# Altium schematic sheet fpga.SchDoc
size 381 x 241 mm; SheetNumber: 13; SheetTotal: 17
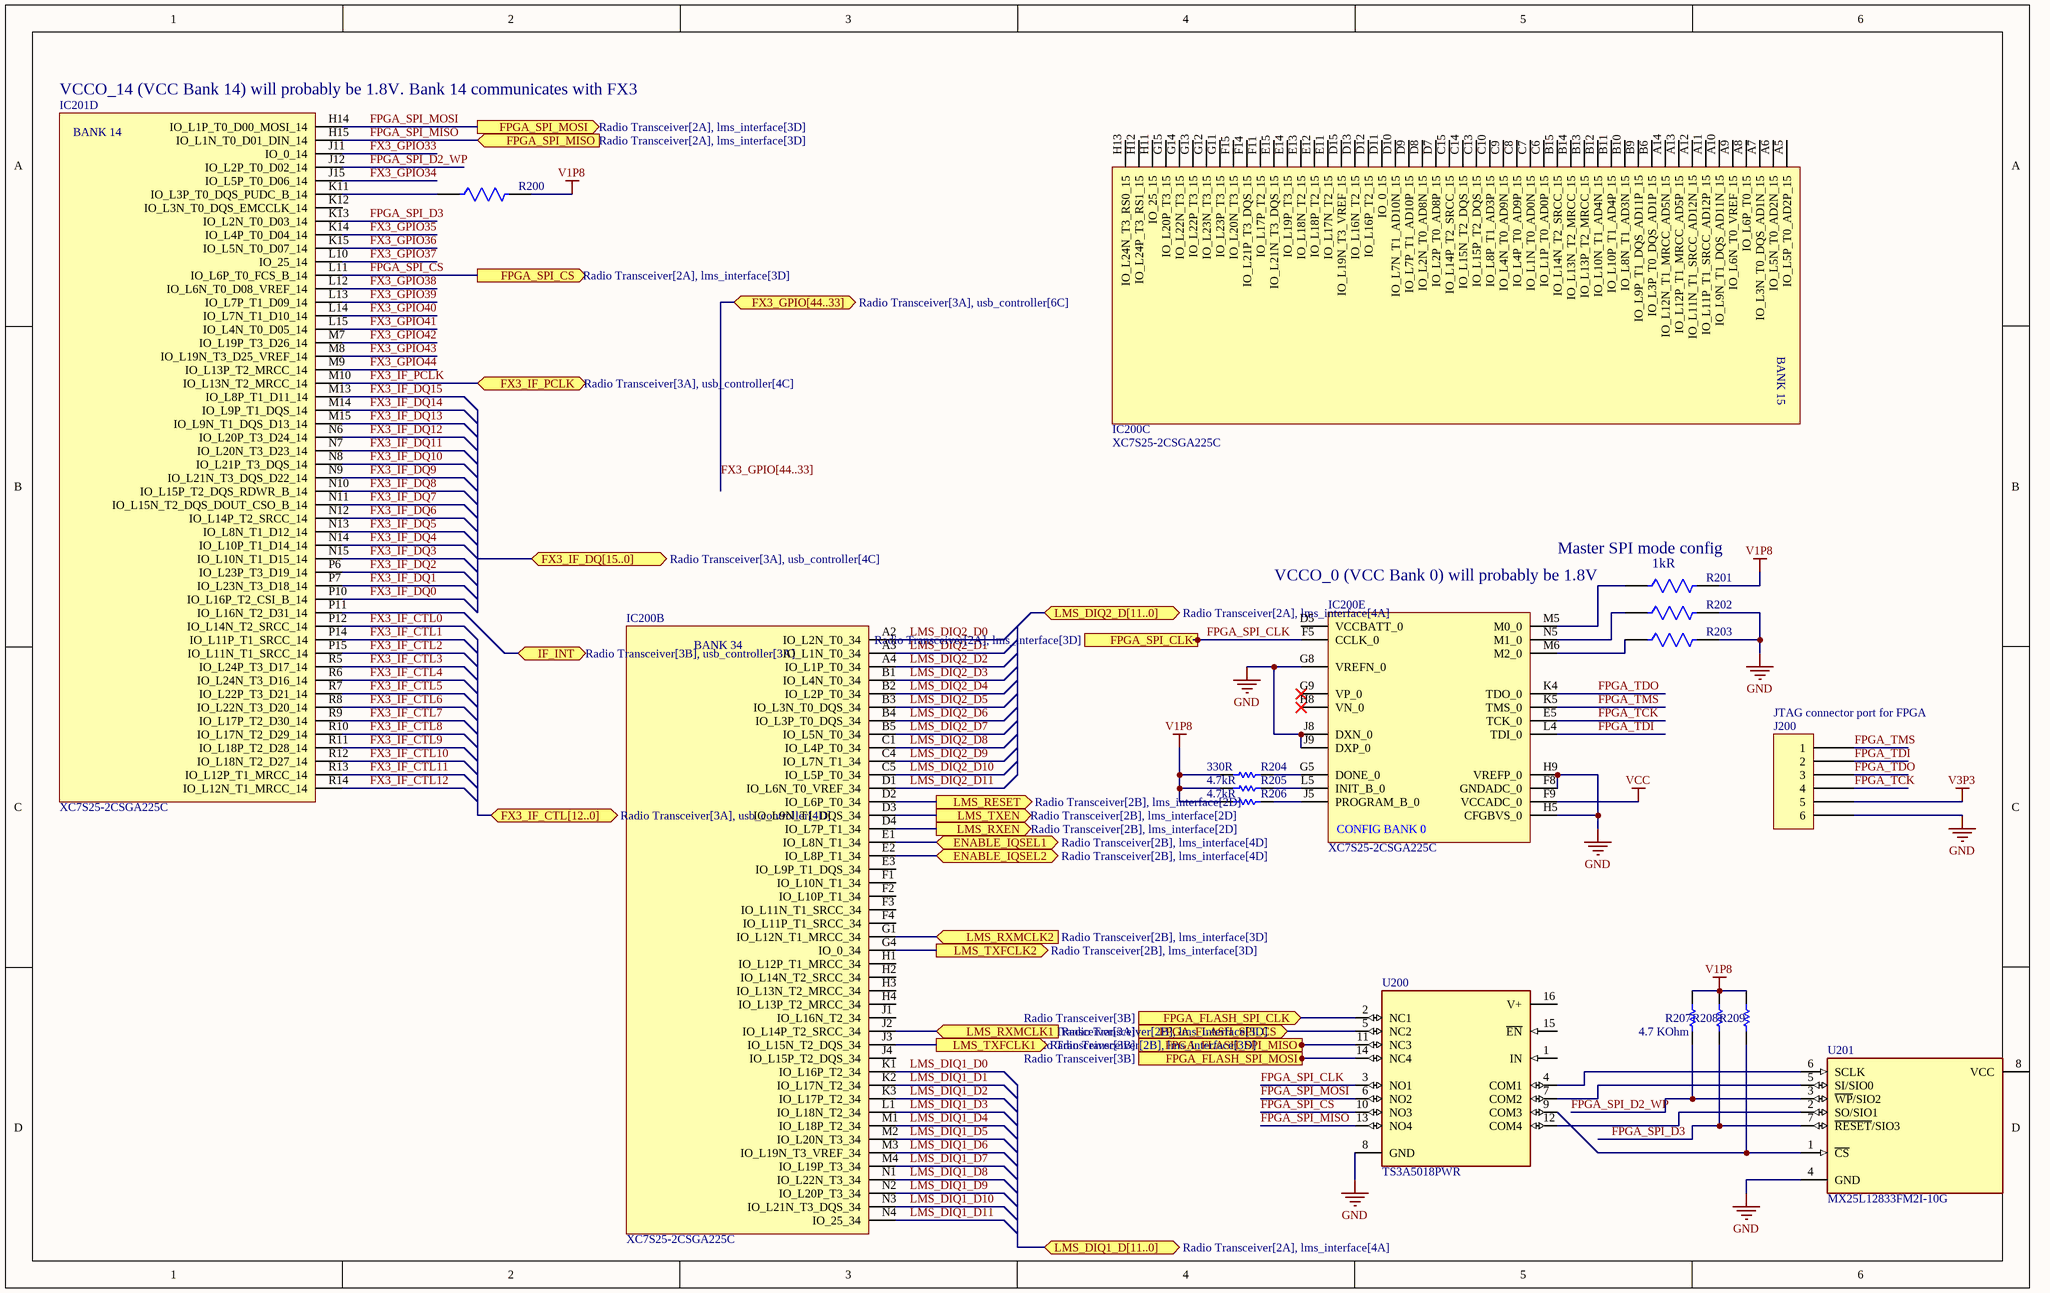
[diagram p0: fpga.SchDoc]

## Parts
(Parts that share a designator on the sheet are numbered #1, #2 ... from top to bottom, then left to right.)
IC200#1  XC7S25-2CSGA225C  [BGA225C80P15X15_1300X1300X140]  (part C of 5)
IC200#2  XC7S25-2CSGA225C  [BGA225C80P15X15_1300X1300X140]  (part E of 6)
IC200#3  XC7S25-2CSGA225C  [BGA225C80P15X15_1300X1300X140]  (part B of 4)
IC201  XC7S25-2CSGA225C  [BGA225C80P15X15_1300X1300X140]  (part D of 5)
J200  JTAG connector port for FPGA  [SULLINS NPPN061BFCN]
R200  AC0603FR-071KL  [FP-AC0603-IPC_B]  (value not drawn)
R201  value 1kR  [FP-AC0603-IPC_B]  (hidden comment: AC0603FR-071KL)
R202  AC0603FR-071KL  [FP-AC0603-IPC_B]  (value not drawn)
R203  AC0603FR-071KL  [FP-AC0603-IPC_B]  (value not drawn)
R204  value 330R  [RESC1005X40X25ML05T05]  (hidden comment: ERJ2RKF3300X)
R205  value 4.7kR  [RESC1005X40X25LL05T05]  (hidden comment: ERJ-2RKF4701X)
R206  value 4.7kR  [RESC1005X40X25LL05T05]  (hidden comment: ERJ-2RKF4701X)
R207  Resistance: 4.7 KOhm  [RESC1005X40X25LL05T05]  (hidden comment: ERJ-2RKF4701X)
R208  ERJ-2RKF4701X  [RESC1005X40X25LL05T05]  (value not drawn)
R209  ERJ-2RKF4701X  [RESC1005X40X25LL05T05]  (value not drawn)
U200  TS3A5018PWR  [FP-PW0016A-IPC_B]
U201  MX25L12833FM2I-10G  [FP-MX25L12833FM2I-10G-MFG]

## Ports
ENABLE_IQSEL1 (bidir, see Radio Transceiver[2B], lms_interface[4D]), ENABLE_IQSEL2 (bidir, see Radio Transceiver[2B], lms_interface[4D]), FPGA_FLASH_SPI_CLK (in, see Radio Transceiver[3B]), FPGA_FLASH_SPI_CS (in, see Radio Transceiver[3A]), FPGA_FLASH_SPI_MISO (out, see Radio Transceiver[3B]), FPGA_FLASH_SPI_MOSI (in, see Radio Transceiver[3B]), FPGA_SPI_CLK (out, see Radio Transceiver[2A], lms_interface[3D]), FPGA_SPI_CS (out, see Radio Transceiver[2A], lms_interface[3D]), FPGA_SPI_MISO (in, see Radio Transceiver[2A], lms_interface[3D]), FPGA_SPI_MOSI (out, see Radio Transceiver[2A], lms_interface[3D]), FX3_GPIO[44..33] (bidir, see Radio Transceiver[3A], usb_controller[6C]), FX3_IF_CTL[12..0] (bidir, see Radio Transceiver[3A], usb_controller[4D]), FX3_IF_DQ[15..0] (bidir, see Radio Transceiver[3A], usb_controller[4C]), FX3_IF_PCLK (bidir, see Radio Transceiver[3A], usb_controller[4C]), IF_INT (bidir, see Radio Transceiver[3B], usb_controller[3A]), LMS_DIQ1_D[11..0] (bidir, see Radio Transceiver[2A], lms_interface[4A]), LMS_DIQ2_D[11..0] (bidir, see Radio Transceiver[2A], lms_interface[4A]), LMS_RESET (out, see Radio Transceiver[2B], lms_interface[2D]), LMS_RXEN (out, see Radio Transceiver[2B], lms_interface[2D]), LMS_RXMCLK1 (in, see Radio Transceiver[2B], lms_interface[3D]), LMS_RXMCLK2 (in, see Radio Transceiver[2B], lms_interface[3D]), LMS_TXEN (out, see Radio Transceiver[2B], lms_interface[2D]), LMS_TXFCLK1 (out, see Radio Transceiver[2B], lms_interface[3D]), LMS_TXFCLK2 (out, see Radio Transceiver[2B], lms_interface[3D])

## Nets
GND: IC200#2.F8(GNDADC_0) IC200#2.G8(VREFN_0) IC200#2.H5(CFGBVS_0) IC200#2.H9(VREFP_0) IC200#2.J8(DXN_0) IC200#2.J9(DXP_0) J200.6 R202.2 R203.2 U200.8(GND) U201.4(GND)
V1P8: R200.2 R201.2 R204.1 R205.1 R206.1 R207.2 R208.2 R209.2
V3P3: J200.5
VCC: IC200#2.F9(VCCADC_0)
ENABLE_IQSEL1: IC200#3.E1(IO_L8N_T1_34) ; port ENABLE_IQSEL1
ENABLE_IQSEL2: IC200#3.E2(IO_L8P_T1_34) ; port ENABLE_IQSEL2
FPGA_FLASH_SPI_CLK: U200.2(NC1) ; port FPGA_FLASH_SPI_CLK
FPGA_FLASH_SPI_CS: U200.5(NC2) ; port FPGA_FLASH_SPI_CS
FPGA_FLASH_SPI_MISO: U200.11(NC3) ; port FPGA_FLASH_SPI_MISO
FPGA_FLASH_SPI_MOSI: U200.14(NC4) ; port FPGA_FLASH_SPI_MOSI
FPGA_SPI_CLK: IC200#2.F5(CCLK_0) U200.3(NO1) ; port FPGA_SPI_CLK
FPGA_SPI_CS: IC201.L11(IO_L6P_T0_FCS_B_14) U200.10(NO3) ; port FPGA_SPI_CS
FPGA_SPI_D2_WP: IC201.J12(IO_L2P_T0_D02_14) R207.1 U201.3(~{WP}/SIO2)
FPGA_SPI_D3: IC201.K13(IO_L2N_T0_D03_14) R208.1 U201.7(~{RESET}/SIO3)
FPGA_SPI_MISO: IC201.H15(IO_L1N_T0_D01_DIN_14) U200.13(NO4) ; port FPGA_SPI_MISO
FPGA_SPI_MOSI: IC201.H14(IO_L1P_T0_D00_MOSI_14) U200.6(NO2) ; port FPGA_SPI_MOSI
FPGA_TCK: IC200#2.E5(TCK_0) J200.4
FPGA_TDI: IC200#2.L4(TDI_0) J200.2
FPGA_TDO: IC200#2.K4(TDO_0) J200.3
FPGA_TMS: IC200#2.K5(TMS_0) J200.1
FX3_GPIO33: IC201.J11(IO_0_14)
FX3_GPIO34: IC201.J15(IO_L5P_T0_D06_14)
FX3_GPIO35: IC201.K14(IO_L4P_T0_D04_14)
FX3_GPIO36: IC201.K15(IO_L5N_T0_D07_14)
FX3_GPIO37: IC201.L10(IO_25_14)
FX3_GPIO38: IC201.L12(IO_L6N_T0_D08_VREF_14)
FX3_GPIO39: IC201.L13(IO_L7P_T1_D09_14)
FX3_GPIO40: IC201.L14(IO_L7N_T1_D10_14)
FX3_GPIO41: IC201.L15(IO_L4N_T0_D05_14)
FX3_GPIO42: IC201.M7(IO_L19P_T3_D26_14)
FX3_GPIO43: IC201.M8(IO_L19N_T3_D25_VREF_14)
FX3_GPIO44: IC201.M9(IO_L13P_T2_MRCC_14)
FX3_IF_CTL0: IC201.P12(IO_L14N_T2_SRCC_14)
FX3_IF_CTL1: IC201.P14(IO_L11P_T1_SRCC_14)
FX3_IF_CTL2: IC201.P15(IO_L11N_T1_SRCC_14)
FX3_IF_CTL3: IC201.R5(IO_L24P_T3_D17_14)
FX3_IF_CTL4: IC201.R6(IO_L24N_T3_D16_14)
FX3_IF_CTL5: IC201.R7(IO_L22P_T3_D21_14)
FX3_IF_CTL6: IC201.R8(IO_L22N_T3_D20_14)
FX3_IF_CTL7: IC201.R9(IO_L17P_T2_D30_14)
FX3_IF_CTL8: IC201.R10(IO_L17N_T2_D29_14)
FX3_IF_CTL9: IC201.R11(IO_L18P_T2_D28_14)
FX3_IF_CTL10: IC201.R12(IO_L18N_T2_D27_14)
FX3_IF_CTL11: IC201.R13(IO_L12P_T1_MRCC_14)
FX3_IF_CTL12: IC201.R14(IO_L12N_T1_MRCC_14)
FX3_IF_DQ0: IC201.P10(IO_L16P_T2_CSI_B_14)
FX3_IF_DQ1: IC201.P7(IO_L23N_T3_D18_14)
FX3_IF_DQ2: IC201.P6(IO_L23P_T3_D19_14)
FX3_IF_DQ3: IC201.N15(IO_L10N_T1_D15_14)
FX3_IF_DQ4: IC201.N14(IO_L10P_T1_D14_14)
FX3_IF_DQ5: IC201.N13(IO_L8N_T1_D12_14)
FX3_IF_DQ6: IC201.N12(IO_L14P_T2_SRCC_14)
FX3_IF_DQ7: IC201.N11(IO_L15N_T2_DQS_DOUT_CSO_B_14)
FX3_IF_DQ8: IC201.N10(IO_L15P_T2_DQS_RDWR_B_14)
FX3_IF_DQ9: IC201.N9(IO_L21N_T3_DQS_D22_14)
FX3_IF_DQ10: IC201.N8(IO_L21P_T3_DQS_14)
FX3_IF_DQ11: IC201.N7(IO_L20N_T3_D23_14)
FX3_IF_DQ12: IC201.N6(IO_L20P_T3_D24_14)
FX3_IF_DQ13: IC201.M15(IO_L9N_T1_DQS_D13_14)
FX3_IF_DQ14: IC201.M14(IO_L9P_T1_DQS_14)
FX3_IF_DQ15: IC201.M13(IO_L8P_T1_D11_14)
FX3_IF_PCLK: IC201.M10(IO_L13N_T2_MRCC_14) ; port FX3_IF_PCLK
IF_INT: IC201.P11(IO_L16N_T2_D31_14) ; port IF_INT
LMS_DIQ1_D0: IC200#3.K1(IO_L16P_T2_34)
LMS_DIQ1_D1: IC200#3.K2(IO_L17N_T2_34)
LMS_DIQ1_D2: IC200#3.K3(IO_L17P_T2_34)
LMS_DIQ1_D3: IC200#3.L1(IO_L18N_T2_34)
LMS_DIQ1_D4: IC200#3.M1(IO_L18P_T2_34)
LMS_DIQ1_D5: IC200#3.M2(IO_L20N_T3_34)
LMS_DIQ1_D6: IC200#3.M3(IO_L19N_T3_VREF_34)
LMS_DIQ1_D7: IC200#3.M4(IO_L19P_T3_34)
LMS_DIQ1_D8: IC200#3.N1(IO_L22N_T3_34)
LMS_DIQ1_D9: IC200#3.N2(IO_L20P_T3_34)
LMS_DIQ1_D10: IC200#3.N3(IO_L21N_T3_DQS_34)
LMS_DIQ1_D11: IC200#3.N4(IO_25_34)
LMS_DIQ2_D0: IC200#3.A2(IO_L2N_T0_34)
LMS_DIQ2_D1: IC200#3.A3(IO_L1N_T0_34)
LMS_DIQ2_D2: IC200#3.A4(IO_L1P_T0_34)
LMS_DIQ2_D3: IC200#3.B1(IO_L4N_T0_34)
LMS_DIQ2_D4: IC200#3.B2(IO_L2P_T0_34)
LMS_DIQ2_D5: IC200#3.B3(IO_L3N_T0_DQS_34)
LMS_DIQ2_D6: IC200#3.B4(IO_L3P_T0_DQS_34)
LMS_DIQ2_D7: IC200#3.B5(IO_L5N_T0_34)
LMS_DIQ2_D8: IC200#3.C1(IO_L4P_T0_34)
LMS_DIQ2_D9: IC200#3.C4(IO_L7N_T1_34)
LMS_DIQ2_D10: IC200#3.C5(IO_L5P_T0_34)
LMS_DIQ2_D11: IC200#3.D1(IO_L6N_T0_VREF_34)
LMS_RESET: IC200#3.D2(IO_L6P_T0_34) ; port LMS_RESET
LMS_RXEN: IC200#3.D4(IO_L7P_T1_34) ; port LMS_RXEN
LMS_RXMCLK1: IC200#3.J2(IO_L14P_T2_SRCC_34) ; port LMS_RXMCLK1
LMS_RXMCLK2: IC200#3.G1(IO_L12N_T1_MRCC_34) ; port LMS_RXMCLK2
LMS_TXEN: IC200#3.D3(IO_L9N_T1_DQS_34) ; port LMS_TXEN
LMS_TXFCLK1: IC200#3.J3(IO_L15N_T2_DQS_34) ; port LMS_TXFCLK1
LMS_TXFCLK2: IC200#3.G4(IO_0_34) ; port LMS_TXFCLK2
NetIC200#2_G5: IC200#2.G5(DONE_0) R204.2
NetIC200#2_J5: IC200#2.J5(PROGRAM_B_0) R206.2
NetIC200#2_L5: IC200#2.L5(INIT_B_0) R205.2
NetIC200#2_M5: IC200#2.M5(M0_0) R201.1
NetIC200#2_M6: IC200#2.M6(M2_0) R203.1
NetIC200#2_N5: IC200#2.N5(M1_0) R202.1
NetIC201_K11: IC201.K11(IO_L3P_T0_DQS_PUDC_B_14) R200.1
NetR209_1: R209.1 U200.9(COM3) U201.1(~{CS})
NetU200_4: U200.4(COM1) U201.6(SCLK)
NetU200_7: U200.7(COM2) U201.5(SI/SIO0)
NetU200_12: U200.12(COM4) U201.2(SO/SIO1)

Not connected (* = marked no-connect by the designer): IC200#1 A5(IO_L5P_T0_AD2P_15) A6(IO_L5N_T0_AD2N_15) A7(IO_L3N_T0_DQS_AD1N_15) A8(IO_L6P_T0_15) A9(IO_L6N_T0_VREF_15) A10(IO_L9N_T1_DQS_AD11N_15) A11(IO_L11P_T1_SRCC_AD12P_15) A12(IO_L11N_T1_SRCC_AD12N_15) A13(IO_L12P_T1_MRCC_AD5P_15) A14(IO_L12N_T1_MRCC_AD5N_15) B6(IO_L3P_T0_DQS_AD1P_15) B9(IO_L9P_T1_DQS_AD11P_15) B10(IO_L8N_T1_AD3N_15) B11(IO_L10P_T1_AD4P_15) B12(IO_L10N_T1_AD4N_15) B13(IO_L13P_T2_MRCC_15) B14(IO_L13N_T2_MRCC_15) B15(IO_L14N_T2_SRCC_15) C6(IO_L1P_T0_AD0P_15) C7(IO_L1N_T0_AD0N_15) C8(IO_L4P_T0_AD9P_15) C9(IO_L4N_T0_AD9N_15) C10(IO_L8P_T1_AD3P_15) C13(IO_L15P_T2_DQS_15) C14(IO_L15N_T2_DQS_15) C15(IO_L14P_T2_SRCC_15) D7(IO_L2P_T0_AD8P_15) D8(IO_L2N_T0_AD8N_15) D9(IO_L7P_T1_AD10P_15) D10(IO_L7N_T1_AD10N_15) D11(IO_0_15) D12(IO_L16P_T2_15) D13(IO_L16N_T2_15) D15(IO_L19N_T3_VREF_15) E11(IO_L17N_T2_15) E12(IO_L18P_T2_15) E13(IO_L18N_T2_15) E14(IO_L19P_T3_15) E15(IO_L21N_T3_DQS_15) F11(IO_L17P_T2_15) F14(IO_L21P_T3_DQS_15) F15(IO_L20N_T3_15) G11(IO_L23P_T3_15) G12(IO_L23N_T3_15) G13(IO_L22P_T3_15) G14(IO_L22N_T3_15) G15(IO_L20P_T3_15) H11(IO_25_15) H12(IO_L24P_T3_RS1_15) H13(IO_L24N_T3_RS0_15); IC200#2 D5(VCCBATT_0) G9(VP_0)* H8(VN_0)*; IC200#3 E3(IO_L9P_T1_DQS_34) F1(IO_L10N_T1_34) F2(IO_L10P_T1_34) F3(IO_L11N_T1_SRCC_34) F4(IO_L11P_T1_SRCC_34) H1(IO_L12P_T1_MRCC_34) H2(IO_L14N_T2_SRCC_34) H3(IO_L13N_T2_MRCC_34) H4(IO_L13P_T2_MRCC_34) J1(IO_L16N_T2_34) J4(IO_L15P_T2_DQS_34); IC201 K12(IO_L3N_T0_DQS_EMCCLK_14); U200 1(IN) 15(~{EN}) 16(V+); U201 8(VCC)

## Buses and harness runs
bus FX3_GPIO[44..33] = port FX3_GPIO[44..33]

## Notes on the sheet
- (near IC201) VCCO_14 (VCC Bank 14) will probably be 1.8V. Bank 14 communicates with FX3
- (near R201) Master SPI mode config
- VCCO_0 (VCC Bank 0) will probably be 1.8V
- (in symbol XC7S25-2CSGA225C, part B) BANK 34
- (in symbol XC7S25-2CSGA225C, part C) BANK 15
- (in symbol XC7S25-2CSGA225C, part D) BANK 14
- (in symbol XC7S25-2CSGA225C, part E) CONFIG BANK 0

## Library data of the parts
IC200#1-IC200#3 IC201 = XC7S25-2CSGA225C: Integrated Circuit; Manufacturer_Name: AMD; Datasheet Link: https://www.xilinx.com/support/documentation/data_sheets/ds180_7Series_Overview.pdf; Height: 1.4mm; Manufacturer_Part_Number: XC7S25-2CSGA225C; Mouser Part Number: 217-XC7S25-2CSGA225C; Mouser Price/Stock: https://www.mouser.co.uk/ProductDetail/Xilinx/XC7S25-2CSGA225C?qs=rrS6PyfT74cKBtNHQKB8Jg%3D%3D
J200 = NPPN061BFCN-RC: CONN HDR 6POS 0.079 GOLD PCB; Manufacturer: Sullins Connector Solutions; Connector Type: Header; Contact Length - Post: 0.094" (2.40mm); Current Rating (Amps): 2A; Material Flammability Rating: UL94 V-0; Number of Positions: 6; Number of Positions Loaded: All; Pitch - Mating: 0.079" (2.00mm); Style: Board to Board; Part Number: NPPN061BFCN-RC; ComponentLink1Description: Datasheet; ComponentLink1URL: https://drawings-pdf.s3.amazonaws.com/10483.pdf; ComponentLink2Description: DigiKey Link; ComponentLink2URL: https://www.digikey.com/en/products/detail/sullins-connector-solutions/NPPN061BFCN-RC/804808; Contact Finish - Mating: Gold; Contact Finish - Post: Gold; Contact Finish Thickness - Mating: Flash; Contact Type: Female Socket; Fastening Type: Push-Pull; Insulation Color: Black; Insulation Height: 0.173" (4.40mm); LastUpdated: 6/21/2022 2:43:22 PM; Lifecycle Status: Active; Minimum Order: 1; Mounting Type: Through Hole; Number of Rows: 1; Operating Temperature: -40°C ~ 105°C; Packaging: Tube; Part Status: Active; Price: 0.40; Series: -; Supplier 1: DigiKey; Supplier Part Number 1: S5751-06-ND; Termination: Solder
R200 R202 R203 = CMP-2000-04828-3: RES 1kΩ 1.00% 0.1W 0603; Voltage Rating: 50V; Power Rating: 100mW; Tolerance: 1%; Temperature Coefficient: 100ppm/°C; Resistance: 1kR; Depth: 0.8mm; Case/Package: 0603; Size Code: 0603; Case Code (Metric): 1608; Height: 0.022inch; Series: AC; Width: 0.031inch; Construction: Rectangular; Length: 0.063inch; Case Code (Imperial): 0603; Package Quantity: 1; RoHS Compliant: Yes; Features: Moisture Resistant; Resistor Type: Thick Film; Max Power Dissipation: 100mW; Packaging: Tape and Reel; Termination: SMD/SMT; Ratings: AEC-Q200; Max Operating Temperature: 155°C; Min Operating Temperature: -55°C; Military Standard: Not; Lead Free: Lead Free; Number of Terminations: 2
R201 = CMP-2000-04828-3: RES 1kΩ 1.00% 0.1W 0603; Voltage Rating: 50V; Power Rating: 100mW; Tolerance: 1%; Temperature Coefficient: 100ppm/°C; Depth: 0.8mm; Case/Package: 0603; Size Code: 0603; Case Code (Metric): 1608; Height: 0.022inch; Series: AC; Width: 0.031inch; Construction: Rectangular; Length: 0.063inch; Case Code (Imperial): 0603; Package Quantity: 1; RoHS Compliant: Yes; Features: Moisture Resistant; Resistor Type: Thick Film; Max Power Dissipation: 100mW; Packaging: Tape and Reel; Termination: SMD/SMT; Ratings: AEC-Q200; Max Operating Temperature: 155°C; Min Operating Temperature: -55°C; Military Standard: Not; Resistance: 1kR; Lead Free: Lead Free; Number of Terminations: 2
R204 = CMP-2002-01143-1: Manufacturer: Panasonic; Part Number: ERJ2RKF3300X
R205-R209 = CMP-2002-01154-4: Chip Resistor, 4.7 KOhm, +/- 1%, 0.1 W, -55 to 155 degC, 0402 (1005 Metric), RoHS, Tape and Reel; Voltage Rating: 50 V; Case\/Package: 0402; Power Rating: 100 mW; Height: 0.35 mm; Mounting Technology: Surface Mount; REACH SVHC: Yes; Max Operating Temperature: 155 degC; ComponentLink1Description: Manufacturer URL; ComponentLink2Description: Datasheet; Pins: 2; PackageReference: 0402; Tolerance: 1%; Case Code (Imperial): 0402; Length: 1 mm; PackageDescription: 2-Pin Surface Mount Device, Body 1 x 0.5 mm; PartNumber: ERJ-2RKF4701X; RoHSCompliant: true; Package Quantity: 1; Radiation Hardening: No; DatasheetVersion: 04/2015; Width: 0.5 mm; Case Code (Metric): 1005; Mount: Surface Mount; ComponentLink1URL: http://www.panasonic.com/; Min Operating Temperature: -55 degC; Packaging: Cut Tape; ComponentLink2URL: http://industrial.panasonic.com/cdbs/www-data/pdf/RDA0000/AOA0000C86.pdf
  R205 R206 R208 R209: Resistance: 4.7 KOhm
U200 = CMP-04892-000072-1: IC SWITCH QUAD SPDT 16TSSOP; Number of Outputs: 8; Bandwidth: 300MHz; Number of Bits: 4; Min Supply Voltage: 2.3V; Operating Supply Voltage: 3V; On-State Resistance: 10R; Max Supply Current: 7uA; Polarity: Non-Inverting; Low Level Output Current: 64mA; Nominal Supply Current: 2.5uA; Turn-Off Delay Time: 6.5ns; Turn-On Delay Time: 8ns; Supply Type: Single; Max Supply Voltage: 3.6V; Min Operating Temperature: -40°C; Weight: 0.002183oz; Radiation Hardening: No; REACH SVHC: No SVHC; Case/Package: TSSOP; Max Operating Temperature: 85°C; Packaging: Tape and Reel; Number of Inputs: 4; Contact Plating: Gold; Mount: Surface Mount; Number of Channels: 4; Package Quantity: 1; RoHS Compliant: Yes; Throw Configuration: SPDT; High Level Output Current: 64mA; Number of Pins: 16; Lead Free: Lead Free; Operating Supply Current: 2.5uA
U201 = CMP-105207-000006-1: IC FLASH 128MBIT SPI/QUAD 8SOP; RoHS Compliant: Yes